# EAGLE board boardv3 (EAGLE 9.1.0)
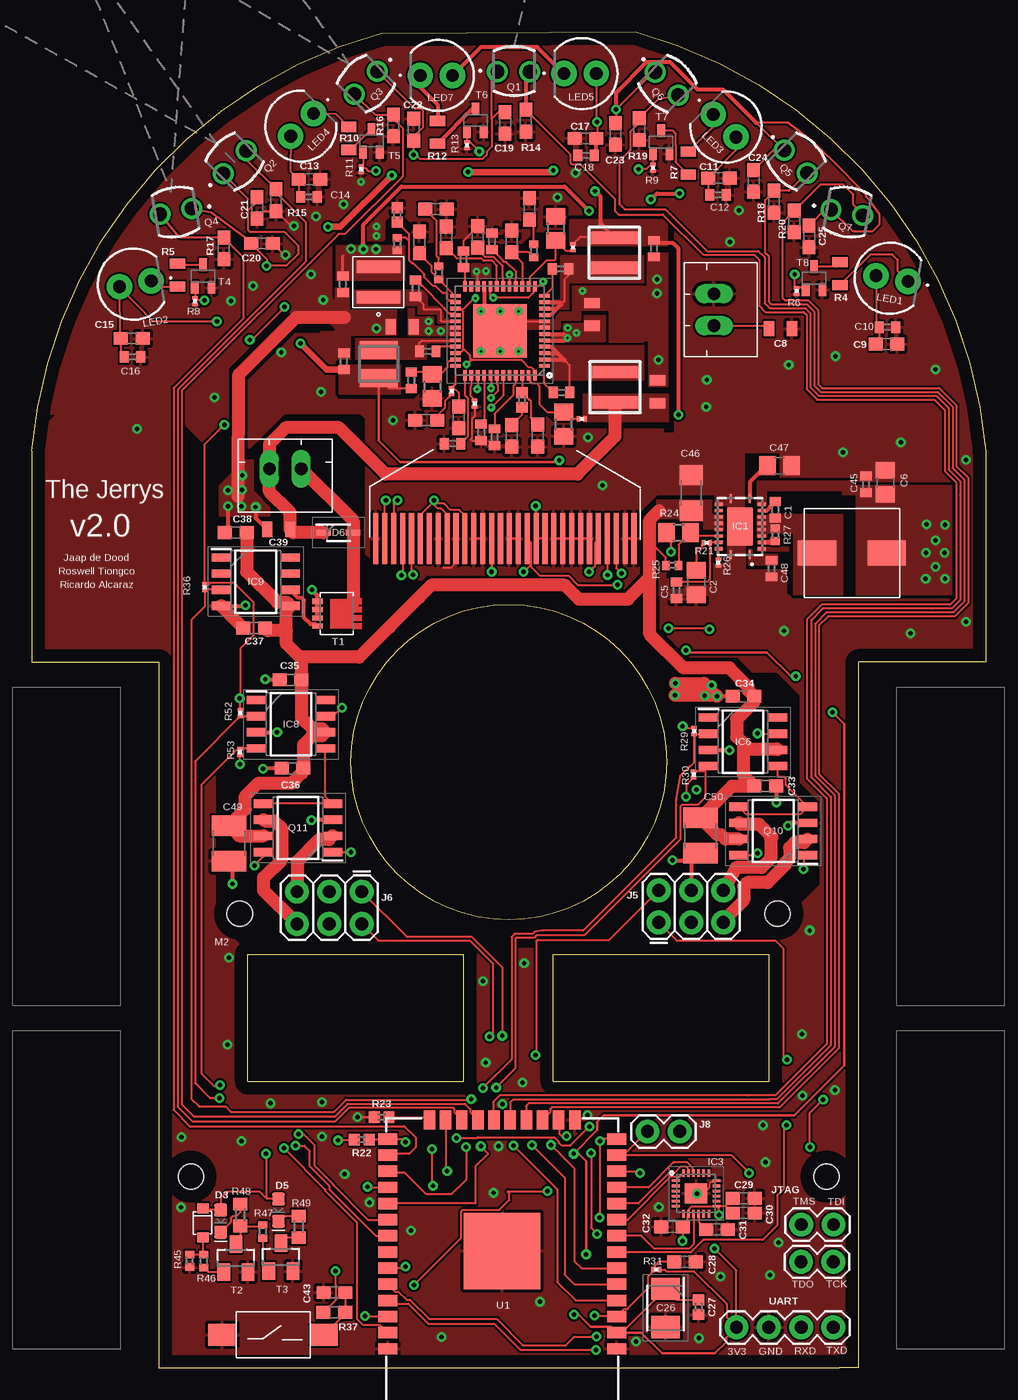
[diagram p3: board, top side]
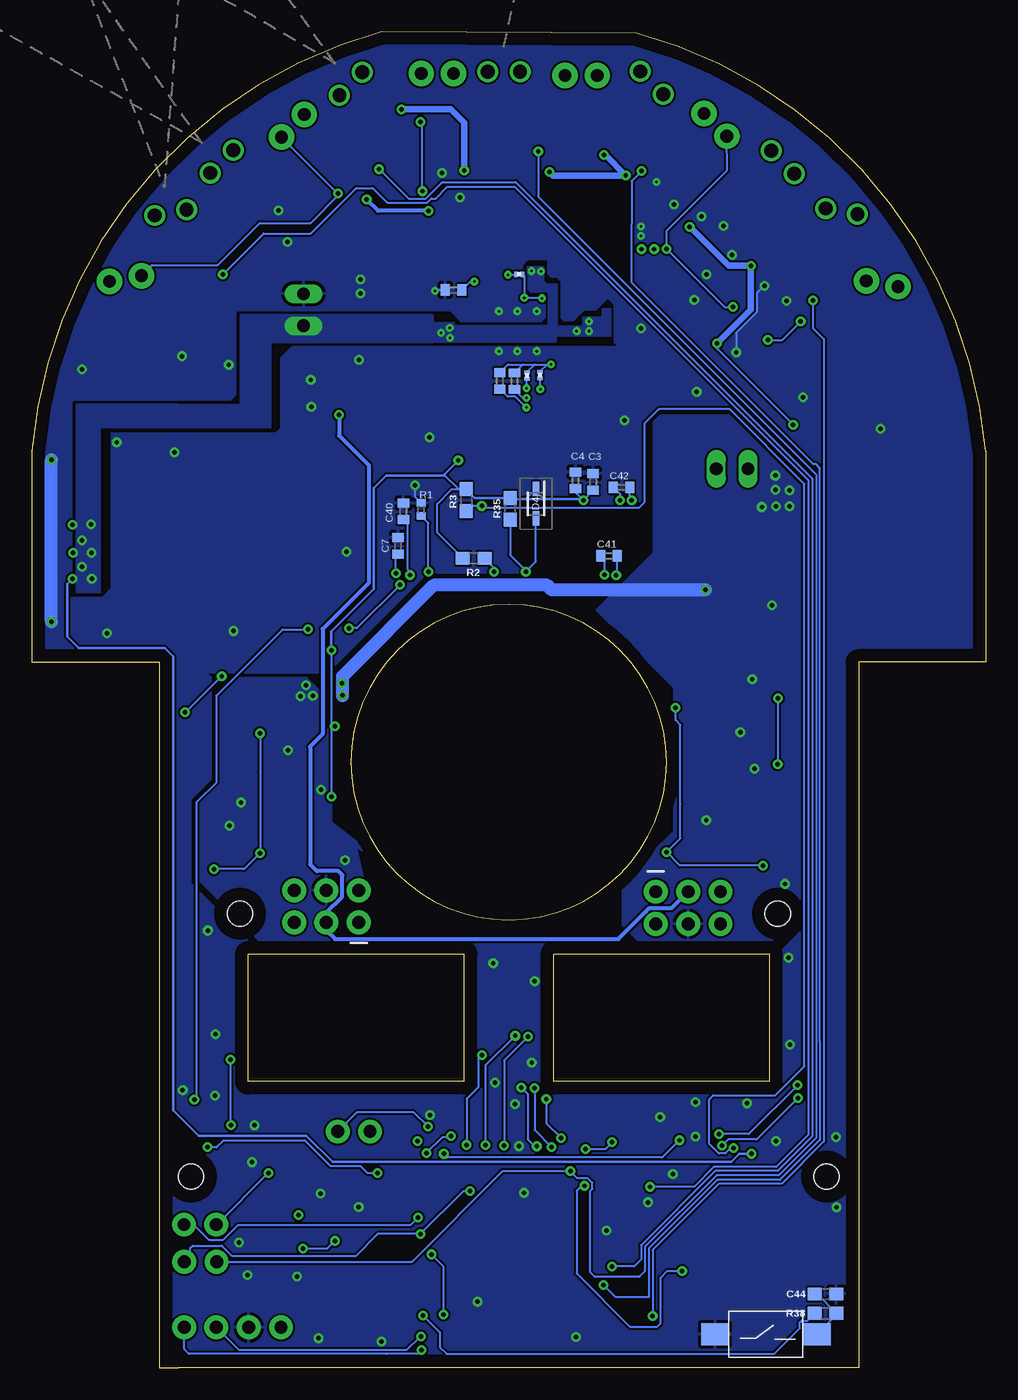
[diagram p4: board, bottom side, seen from below]

Size 75.02 x 105.1 mm. Coordinates in mm from the lower left corner, seen from the top.
Outline: 10,0 63.51,0 65.01,0.01 65.01,55.5 75.02,55.51 75.02,72.11 arc70 47.5,105.1 27.5,105 arc70 0,72.1 0,55.5 10,55.5 10,0
Outline: 16.99,22.52 16.99,32.52 33.99,32.52 33.99,22.52 16.99,22.52
Outline: 41.01,22.52 41.01,32.52 58.01,32.52 58.01,22.52 41.01,22.52
Outline: 25.1,47.64 arc-180 49.92,47.64 arc-180 25.1,47.64
Copper layers (1*16): Top 0.035mm / dielectric 1.5mm / Bottom 0.035mm
Design rules "default *": minimum track width 3.5mil, minimum drill 0.2mm, track to track 6mil, track to pad 6mil, pad to pad 6mil, via to via 6mil, smd to smd 6mil, copper to edge 40mil, drill to drill 6mil, minimum pad ring 10mil, minimum via ring 8mil, stop-mask expansion 4mil, vias tented up to drill 0mil, thermal gap 10mil
Holes 2 mm at 16.35,35.71 58.65,35.71 12.51,15.03 62.5,15.03

## Footprints (pad centres in the part's own frame; a part is rotated, then mirrored left to right if it is on the bottom)
C0402 = smd 0.7 x 0.9: 1 -0.65,0; 2 0.65,0
C0805 = smd 1.3 x 1.5: 1 -0.95,0; 2 0.95,0
0805 = smd 0.8 x 1.2: 1 -0.9,0; 2 0.9,0
0603 = smd 1.1 x 1: 1 -0.85,0; 2 0.85,0
CAPPM3528X210N = smd 1.75 x 2.25: 1 -1.5,0; 2 1.5,0
0402 = smd 0.85 x 0.9: 1 -0.58,0; 2 0.58,0
C1206 = smd 1.6 x 1.8: 1 -1.4,0; 2 1.4,0
C1210 = smd 1.6 x 2.7: 1 -1.4,0; 2 1.4,0
C0603 = smd 1.1 x 1: 1 -0.85,0; 2 0.85,0
LED-0603 = smd 1 x 1: A -0.877,0; C 0.877,0
SOD2713X115N = smd 1.125 x 0.5: 1 -1.162,0; 2 1.162,0
RHL(R-PVQFN-N20)_1 = smd 0.7 x 0.25: 1 -2.2,-0.75; 10 2.2,-0.75; 11 2.2,0.75; 20 -2.2,0.75 | smd 0.25 x 0.7: 2 -1.75,-1.7; 3 -1.25,-1.7; 4 -0.75,-1.7; 5 -0.25,-1.7; 6 0.25,-1.7; 7 0.75,-1.7; 8 1.25,-1.7; 9 1.75,-1.7; 12 1.75,1.7; 13 1.25,1.7; 14 0.75,1.7; 15 0.25,1.7; 16 -0.25,1.7; 17 -0.75,1.7; 18 -1.25,1.7; 19 -1.75,1.7 | smd 3.05 x 2.05: 21 0,0
QFN40P300X300X95-25N = smd 0.6 x 0.2: 1 -1.6,1; 2 -1.6,0.6; 3 -1.6,0.2; 4 -1.6,-0.2; 5 -1.6,-0.6; 6 -1.6,-1; 13 1.6,-1; 14 1.6,-0.6; 15 1.6,-0.2; 16 1.6,0.2; 17 1.6,0.6; 18 1.6,1 | smd 0.2 x 0.6: 7 -1,-1.6; 8 -0.6,-1.6; 9 -0.2,-1.6; 10 0.2,-1.6; 11 0.6,-1.6; 12 1,-1.6; 19 1,1.6; 20 0.6,1.6; 21 0.2,1.6; 22 -0.2,1.6; 23 -0.6,1.6; 24 -1,1.6 | smd 1.75 x 1.59: 25 0,0
SOIC127P600X175-8N = smd 1.525 x 0.65: 1 -2.712,1.905; 2 -2.712,0.635; 3 -2.712,-0.635; 4 -2.712,-1.905; 5 2.712,-1.905; 6 2.712,-0.635; 7 2.712,0.635; 8 2.712,1.905
2_PIN_JST-XH = drill 1 long: P$1 2.45,3.4; P$2 4.95,3.4
1X02 = drill 1.016 pad 1.88: 1 0,0; 2 2.54,0
2X3 = drill 1.016 pad 1.88: 1 0,0; 2 0,2.54; 3 2.54,0; 4 2.54,2.54; 5 5.08,0; 6 5.08,2.54
XAL4030-332MEB = smd 0.98 x 3.7: 1 -1.185,0; 2 1.185,0
SDR0302-471KL = smd 3 x 1.4: 1 0,1.1; 2 0,-1.1
XFL4020-222ME = smd 0.98 x 3.4: 1 -1.185,0; 2 1.185,0
SFH_4556P = drill 1 pad 2: 1 -1.27,0; 2 1.27,0
3X6X2.5MMSPB = smd 2.2 x 1.7: 1 0,0; 2 8,0
DO-219AC = smd 0.8 x 0.9: A 0,0; K 2.3,0
QFN50P700X700X100-49N = smd 0.8 x 0.3: 1 -3.5,2.75; 2 -3.5,2.25; 3 -3.5,1.75; 4 -3.5,1.25; 5 -3.5,0.75; 6 -3.5,0.25; 7 -3.5,-0.25; 8 -3.5,-0.75; 9 -3.5,-1.25; 10 -3.5,-1.75; 11 -3.5,-2.25; 12 -3.5,-2.75; 25 3.5,-2.75; 26 3.5,-2.25; 27 3.5,-1.75; 28 3.5,-1.25; 29 3.5,-0.75; 30 3.5,-0.25; 31 3.5,0.25; 32 3.5,0.75; 33 3.5,1.25; 34 3.5,1.75; 35 3.5,2.25; 36 3.5,2.75 | smd 0.3 x 0.8: 13 -2.75,-3.5; 14 -2.25,-3.5; 15 -1.75,-3.5; 16 -1.25,-3.5; 17 -0.75,-3.5; 18 -0.25,-3.5; 19 0.25,-3.5; 20 0.75,-3.5; 21 1.25,-3.5; 22 1.75,-3.5; 23 2.25,-3.5; 24 2.75,-3.5; 37 2.75,3.5; 38 2.25,3.5; 39 1.75,3.5; 40 1.25,3.5; 41 0.75,3.5; 42 0.25,3.5; 43 -0.25,3.5; 44 -0.75,3.5; 45 -1.25,3.5; 46 -1.75,3.5; 47 -2.25,3.5; 48 -2.75,3.5 | smd 4.18 x 4.18: 49 0,0
TEFT4300 = drill 1.09 pad 1.65: 1 -1.309,-0.054; 2 1.231,-0.054
R0402 = smd 0.6 x 0.7: 1 -0.5,0; 2 0.5,0
R0201 = smd 0.28 x 0.43: 1 -0.255,0; 2 0.255,0
R0805 = smd 1.3 x 1.5: 1 -0.95,0; 2 0.95,0
R0603 = smd 1 x 1.1: 1 -0.85,0; 2 0.85,0
R0402' = smd 0.7 x 0.9: 1 -0.65,0; 2 0.65,0
SOT1210 = smd 0.4 x 0.83: 1 -0.975,-1.535; 2 -0.325,-1.535; 3 0.325,-1.535; 4 0.975,-1.535 | smd 0 x 0: MB 0,0.432
SOT23 = smd 1 x 1.4: 1 -0.95,-1.1; 2 0.95,-1.1; 3 0,1.1
SOT323 = smd 0.6 x 1: D 0,0.9; G -0.65,-0.9; S 0.65,-0.9
ESP-WROOM-32 = smd 0.9 x 1.5: 1 7.7,9; 2 6.43,9; 3 5.16,9; 4 3.89,9; 5 2.62,9; 6 1.35,9; 7 0.08,9; 8 -1.19,9; 9 -2.46,9; 10 -3.73,9; 11 -5,9; 12 -6.27,9; 13 -7.54,9; 14 -8.81,9; 25 -8.81,-9; 26 -7.54,-9; 27 -6.27,-9; 28 -5,-9; 29 -3.73,-9; 30 -2.46,-9; 31 -1.19,-9; 32 0.08,-9; 33 1.35,-9; 34 2.62,-9; 35 3.89,-9; 36 5.16,-9; 37 6.43,-9; 38 7.7,-9 | smd 1.5 x 0.9: 15 -10.3,5.715; 16 -10.3,4.445; 17 -10.3,3.175; 18 -10.3,1.905; 19 -10.3,0.635; 20 -10.3,-0.635; 21 -10.3,-1.905; 22 -10.3,-3.175; 23 -10.3,-4.445; 24 -10.3,-5.715 | smd 6 x 6: GND 0,0
30PINFPC_P0.7MM = smd 0.4 x 4: 1 0,0; 2 0.7,0; 3 1.4,0; 4 2.1,0; 5 2.8,0; 6 3.5,0; 7 4.2,0; 8 4.9,0; 9 5.6,0; 10 6.3,0; 11 7,0; 12 7.7,0; 13 8.4,0; 14 9.1,0; 15 9.8,0; 16 10.5,0; 17 11.2,0; 18 11.9,0; 19 12.6,0; 20 13.3,0; 21 14,0; 22 14.7,0; 23 15.4,0; 24 16.1,0; 25 16.8,0; 26 17.5,0; 27 18.2,0; 28 18.9,0; 29 19.6,0; 30 20.3,0
MLC7540 = smd 2 x 3: P$1 0,0; P$2 0,5.5
1X04 = drill 1.016 pad 1.88: 1 0,0; 2 2.54,0; 3 5.08,0; 4 7.62,0

## Placement (x,y rotation side)
C1  100nF  [C0402]  58.47,67.5 270 top
C2  1nF  [C0805]  52.26,61.77 270 top
C3  1uF  [C0402]  30.87,69.68 90 bottom
C4  1uF  [C0402]  32.26,69.8 90 bottom
C5  43pF  [C0402]  50.7,61.17 270 top
C6  100nF  [C0805]  67.13,69.65 90 top
C7  2.2uF  [C0402]  46.22,64.66 90 bottom
C8  22uF  [0805]  58.88,81.75 180 top
C9  4.7uF  [0603]  67.23,80.52 0 top
C10  0.1uF  [C0402]  67.3,81.86 0 top
C11  4.7uF  [0603]  54.03,93.59 0 top
C12  0.1uF  [C0402]  53.98,92.26 0 top
C13  4.7uF  [0603]  21.83,93.49 0 top
C14  0.1uF  [C0402]  21.79,92.11 0 top
C15  4.7uF  [0603]  7.86,80.97 0 top
C16  0.1uF  [C0402]  7.91,79.52 0 top
C17  4.7uF  [0603]  43.54,96.71 180 top
C18  0.1uF  [C0402]  43.58,95.36 180 top
C19  2.2uF  [0603]  37.22,97.93 270 top
C20  2.2uF  [0603]  18.1,88.44 0 top
C21  2.2uF  [0603]  17.72,91.23 270 top
C22  2.2uF  [0603]  30.04,97.4 90 top
C23  2.2uF  [0603]  45.9,97.06 270 top
C24  2.2uF  [0603]  56.76,93.36 270 top
C25  2.2uF  [0603]  61.13,89.01 270 top
C26  100uF Tantal.  [CAPPM3528X210N]  49.84,4.71 270 top
C27  1.0uF  [0402]  52.44,4.76 270 top
C28  1nF  [0603]  51.38,8.33 0 top
C29  0.1uF  [0603]  55.99,13.33 0 top
C30  2.2uF  [0603]  55.99,12.17 0 top
C31  0.1uF  [0603]  53.89,10.88 0 top
C32  10nF  [0603]  50.35,11.09 180 top
C33  0.1uF  [0603]  57.68,45.76 0 top
C34  4.7uF  [0603]  55.96,52.82 180 top
C35  0.1uF  [0603]  20.35,54.12 180 top
C36  4.7uF  [0603]  20.5,47.16 180 top
C37  0.1uF  [0603]  17.49,58.2 180 top
C38  4.7uF  [0603]  16.04,65.71 180 top
C39  22uF  [0805]  19.42,65.95 180 top
C40  4.7uF  [C0402]  45.8,67.37 90 bottom
C41  1uF  [C0402]  29.63,63.86 180 bottom
C42  1uF  [C0402]  28.63,69.27 180 bottom
C43  1nF  [0603]  23.82,5.92 0 top
C44  1nF  [0603]  12.59,5.8 180 bottom
C45  10uF  [C0402]  65.6,69.49 90 top
C46  33uF  [C1206]  51.87,68.82 90 top
C47  8.2nF  [C0805]  58.79,70.96 0 top
C48  4.7uF  [C0402]  58.18,62.87 270 top
C49  100UF_CERAMIC  [C1210]  15.5,41.25 270 top
C50  100UF_CERAMIC  [C1210]  52.58,41.87 270 top
CBST1  100nF  [C0402]  41.67,76.72 0 top
CBST2  100nF  [C0402]  41.58,86.44 0 top
CBST3  100nF  [C0402]  30.19,84.92 90 top
CBST4  100nF  [C0402]  31.14,79.96 0 top
CCOMP5  25pF  [C0603]  37.75,88.61 90 top
CCOMP6  1.2nF  [C0603]  31.79,91.14 0 top
CCOMP7  43pF  [C0603]  30.48,88.52 90 top
CCOMP8  1.8nF  [C0603]  39.14,91.15 270 top
CCOMP9  4.7nF  [C0603]  31.02,74.54 0 top
CCOMP10  82pF  [C0603]  33.57,74.77 270 top
CCOMP11  1.2nF  [C0603]  37.74,73.3 90 top
CCOMP13  39pF  [C0603]  39.79,73.33 90 top
CIN1  22.2uF  [0805]  29.13,81.89 180 top
CIN2  22.2uF  [0805]  44.05,82.86 90 top
CIN3  22.2uF  [0805]  49.2,76.77 90 top
COUT1  10uF  [C0402]  24.46,85.24 270 top
COUT5  10uF  [C0402]  48.93,88.04 270 top
COUT6  10uF  [C0402]  24.54,79.18 270 top
CSS5  68nF  [C0402]  36.2,88.61 90 top
CSS6  68nF  [C0402]  33.96,87.2 90 top
CSS7  68nF  [C0402]  33.09,72.7 180 top
CSS8  68nF  [C0402]  36.4,73.21 90 top
CVDD1  3.3uF  [C0402]  41.85,84.78 180 bottom
CVDDA1  4.7uF  [0603]  32.59,88.92 270 top
CVDDG1  10uF  [C0603]  35.08,88.95 90 top
D3  GREEN  [LED-0603]  14.85,11.54 270 top
D4  1N4148WS-E3-08  [SOD2713X115N]  35.37,67.98 270 bottom
D5  RED  [LED-0603]  19.4,12.4 270 top
D6  1N4148WS-E3-08  [SOD2713X115N]  24.11,65.7 0 top
IC1  TPS61088RHLR  [RHL(R-PVQFN-N20)_1]  55.71,66.18 90 top
IC3  MPU-6500  [QFN40P300X300X95-25N]  52.24,13.71 0 top
IC6  UCC27523DR  [SOIC127P600X175-8N]  55.94,49.24 0 top
IC8  UCC27523DR  [SOIC127P600X175-8N]  20.38,50.62 0 top
IC9  UCC27523DR  [SOIC127P600X175-8N]  17.61,61.84 0 top
J2  2_PIN_JST-XH  [2_PIN_JST-XH]  57.05,79.53 90 top
J3  [1X02]  60.51,11.26 0 top
J5  [2X3]  49.31,35.02 0 top
J6  [2X3]  25.94,37.45 180 top
J7  2_PIN_JST-XH  [2_PIN_JST-XH]  16.24,67.31 0 top
J8  [1X02]  50.96,18.58 180 top
JTAG  [1X02]  60.49,8.34 0 top
L5  XAL4030-332MEB  [XAL4030-332MEB]  45.82,87.71 270 top
L6  SDR0302-100ML  [SDR0302-471KL]  27.28,78.96 0 top
L7  XAL4030-472MEB  [XAL4030-332MEB]  45.86,77.14 90 top
L8  XFL4020-472MEB  [XFL4020-222ME]  27.26,85.4 90 top
LED1  SFH4545  [SFH_4556P]  67.65,85.69 170 top
LED2  SFH4545  [SFH_4556P]  8.14,85.27 190 top
LED3  SFH4545  [SFH_4556P]  54.49,97.71 315.1 top
LED4  SFH4545  [SFH_4556P]  21.26,97.78 224.9 top
LED5  SFH4545  [SFH_4556P]  43.12,101.81 0 top
LED7  SFH4545  [SFH_4556P]  31.82,101.67 0 top
PB1  [3X6X2.5MMSPB]  14.98,2.59 0 top
PB2  [3X6X2.5MMSPB]  21.29,2.63 0 bottom
PLZ6V2B-G3/H  6.3V Zener  [DO-219AC]  13.45,10.25 90 top
PS2  TPS65400RGZT  [QFN50P700X700X100-49N]  36.82,81.57 180 top
Q1  TEFT4300  [TEFT4300]  37.93,102.02 0 top
Q2  TEFT4300  [TEFT4300]  15.95,94.9 44.9 top
Q3  TEFT4300  [TEFT4300]  26.28,101.02 224.9 top
Q4  TEFT4300  [TEFT4300]  11.31,90.92 190 top
Q5  TEFT4300  [TEFT4300]  60.15,94.9 315.1 top
Q6  TEFT4300  [TEFT4300]  49.99,101.02 315.1 top
Q7  TEFT4300  [TEFT4300]  64.15,90.92 350 top
Q10  ZXMHC3F381N8TC  [SOIC127P600X175-8N]  58.31,42.23 180 top
Q11  ZXMHC3F381N8TC  [SOIC127P600X175-8N]  20.93,42.47 180 top
R1  910k  [R0402]  44.4,67.53 270 bottom
R2  4.7k  [0603]  40.26,63.68 180 bottom
R3  4.7k  [0603]  40.85,68.26 90 bottom
R4  0.75  [0805]  63.55,86.08 270 top
R5  0.75  [0805]  11.45,85.96 270 top
R6  10k  [R0201]  60.15,84.71 90 top
R7  0.75  [0805]  51.63,94.77 90 top
R8  10k  [R0201]  12.84,83.91 90 top
R9  10k  [R0201]  48.85,94.41 90 top
R10  0.75  [0805]  24.93,96.71 90 top
R11  10k  [R0201]  25.91,94.28 90 top
R12  5R  [0805]  31.91,97.19 90 top
R13  10k  [R0201]  34.22,96.17 90 top
R14  1.8k  [0603]  38.86,98.1 90 top
R15  1.8k  [0603]  19.21,91.85 90 top
R16  1.8k  [0603]  28.44,97.73 90 top
R17  1.8k  [0603]  15.11,88.06 90 top
R18  1.8k  [0603]  58.38,91.73 90 top
R19  1.8k  [0603]  47.78,97.44 90 top
R20  1.8k  [0603]  59.97,90.19 90 top
R21  36.5k  [R0201]  53.09,64.9 0 top
R22  5K(NC)  [0402]  25.95,17.95 180 top
R23  5K(NC)  [0402]  27.51,19.71 0 top
R24  92k  [R0805]  50.87,65.7 0 top
R25  825k  [R0402]  50.37,63.12 180 top
R26  105k  [R0201]  53.99,63.33 90 top
R27  267k  [R0402]  58.48,65.53 90 top
R29  10k  [R0201]  52.09,50.08 90 top
R30  10k  [R0201]  52.05,46.68 270 top
R31  12k  [R0201]  49.1,7.72 0 top
R35  4.7k  [0603]  37.4,67.58 90 bottom
R36  10k  [R0201]  13.61,61.4 90 top
R37  470  [0603]  23.79,4.36 180 top
R38  470  [0603]  12.6,4.29 180 bottom
R45  10k  [R0402]  12.41,8.41 90 top
R46  47k  [R0402]  13.52,8.39 270 top
R47  47k  [R0402]  18.17,10.71 270 top
R48  [R0603]  16.41,12.02 90 top
R49  [R0603]  20.98,11.09 90 top
R52  10k  [R0201]  16.4,51.51 90 top
R53  10k  [R0201]  16.36,48.45 270 top
RCOMP5  10.7k  [0402]  38.55,76.14 270 top
RCOMP6  10.7k  [R0402]  39.49,87.86 270 top
RCOMP7  9.31k  [R0402]  32.01,86.13 270 top
RCOMP8  10k  [R0201]  33.02,76.83 270 top
RFBB5  20k  [R0805]  41.2,89.62 270 top
RFBB6  14k  [0402]  28.74,90.69 270 top
RFBB7  24k  [R0805]  31.5,77.2 270 top
RFBB8  20k  [R0805]  41.83,74.23 90 top
RFBT5  75k  [R0402']  29.84,77.68 90 top
RFBT6  105k  [R0201]  43.25,74.65 0 top
RFBT8  21k  [R0402]  28.74,88.39 270 top
RFTB5  105k  [R0201]  42.56,88.14 90 top
ROSC1  113k  [R0402']  35.34,73.58 90 top
RPMU7  23.7k  [R0201]  34.83,75.86 270 top
RPMU8  10k  [R0201]  36.08,78.06 90 bottom
RPMU9  10k  [R0201]  35.06,78.09 90 bottom
RPMU10  2.94k  [R0402']  37.06,77.62 90 bottom
RPMU11  2.94k  [R0402']  38.22,77.63 90 bottom
RPMU12  10k  [R0201]  36.7,86.02 0 bottom
T1  PSMN3R9-25MLC  [SOT1210]  24,59.32 270 top
T2  BC847  [SOT23]  16.05,8.63 0 top
T3  BC847  [SOT23]  19.59,8.7 0 top
T4  DMN3150LW  [SOT323]  13.47,85.88 0 top
T5  DMN3150LW  [SOT323]  26.71,96.52 0 top
T6  DMN3150LW  [SOT323]  34.89,98.13 0 top
T7  DMN3150LW  [SOT323]  49.5,96.41 0 top
T8  DMN3150LW  [SOT323]  61.52,85.72 0 top
U1  ESP-WROOM-32  [ESP-WROOM-32]  36.99,9.19 270 top
U$8  SSD1306  [30PINFPC_P0.7MM]  27.06,65.24 0 top
U$9  MLC7540  [MLC7540]  67.25,64.09 90 top
UART  [1X04]  55.42,3.17 0 top

## Tracks (layer width: path | path; a pad name or v marks a point on that pad's centre or on a via)
2V  (via drill 0.35)
  Top 0.152: C16.1 7.01,79.77 C15.1 6.91,81.07 LED2.2 9.56,82.31 v14.55,82.31 | LED4.2 20.34,94.13 C13.1 20.98,92.27 C14.1 | LED3.2 55.32,95.73 C11.1 53.18,92.41 C12.1 | LED1.2 66.4,82.11 C10.1 66.65,80.79 C9.1 | v19.88,83.45 17.29,80.86 v17.14,80.86
  Top 0.254: COUT1.1 24.46,87.45
  Top 0.305: v26.07,88 26.07,89.93 29.06,92.92 41.91,92.92 v43.82,91.01 | v48.68,91.9 49.15,92.37 v50.94,92.37
  Bottom 0.152: LED4.2 20.34,94.2 25.1,89.44 v25.1,88.01 20.54,83.45 v19.88,83.45 | LED3.2 v50.94,92.37 50.86,92.29 53.09,90.06 57.1,90.06 60.41,86.75 65.57,86.75 LED1.2 | v17.14,80.86 16,80.86 v14.55,82.31
  Bottom 0.305: v43.82,91.01 47.79,91.01 v48.68,91.9
  other vias: 27.08,88
  pour Top (no thermals): 29.29,85.56 23.99,85.56 23.99,88.28 29.29,88.28
3V3  (via drill 0.35)
  Top 0.152: Q4.1 14.12,90.9 16.67,89.02 C20.1 18.47,87.22 v18.47,86.69 20.01,86.69 20.94,87.62 20.94,87.89 20.94,88.27 19.84,89.37 17.16,89.37 16.99,89.54 16.99,91.02 | C21.1 17.72,91.75 16.99,91.02 | 16.99,91.02 16.99,91.96 Q2.1 | 36.17,98.26 36.17,96.04 35.8,95.67 35.8,95.45 35.44,95.09 30.56,95.09 30.04,95.61 30.04,95.44 v30.02,95.42 30.02,96.45 30.04,96.47 C22.1 30.04,96.88 30.77,97.61 30.77,98.89 30.63,99.03 30.13,99.03 Q3.1 | 36.17,98.26 36.17,101.52 Q1.1 | 36.17,98.26 36.69,98.78 C19.1 | C25.1 62.4,91.13 Q7.1 64.55,89.43 66.14,89.43 66.68,89.97 66.68,90.76 65.95,91.78 65.62,92.11 65.62,92.24 63.72,94.2 61.53,96.39 59.45,97.96 57,97.96 56.97,97.93 Q5.1 58.32,95.77 C24.1 | C23.1 45.95,97.96 v45.95,99 48.35,101.39 Q6.1 | RFBT5.1 28.11,77.03 L6.2 | v15.14,74.18 13.61,72.65 R36.2 13.94,61.66 14.04,61.76 15.89,61.76 17.43,60.22 17.43,57.61 16.4,56.59 16.4,52.73 v16.35,52.68 16.35,51.81 R52.2 | U1.2 46.39,2.76 C26.1 50.71,5.34 C27.1 | R31.2 49.77,7.72 49.88,7.6 52.06,7.6 54.64,5.02 54.64,3.95 UART.1 55.42,7.65 v53.68,9.39 | C29.1 54.52,12.71 IC3.13 | C30.1 54.6,12.71 IC3.13 | v51.18,9.98 51.2,10 C32.1 51.2,11.35 51.57,11.71 51.57,12.04 IC3.8 51.71,12.18 51.71,12.5 51.89,12.69 53.21,12.69 53.23,12.71 IC3.13 | R22.2 25.31,17.89 v24.09,17.89 | v51.19,50.47 51.32,50.33 R29.2 | R30.2 51.45,45.83 v51.45,44.91 | v16.36,47.47 R53.2 | v54.04,12.02 54.04,12.51 IC3.13 | U$8.6 30.56,67.09 31.5,68.03 31.54,67.99 | 31.54,67.99 31.93,67.6 32.2,67.6 32.66,67.13 U$8.9 | U$8.11 34.06,67.06 33.63,67.49 32.91,67.49 32.43,67.97 31.56,67.97 31.54,67.99
  Top 0.203: L6.2 27.28,72.93 28.98,71.23 41.33,71.23 v41.48,71.38 | v51.46,56.45 51.63,56.28 57.79,56.28 59.67,54.4 v60.08,54.4 | v62.97,51.57 63.89,50.65 63.89,23.78 59.95,19.84 44.99,19.84 44.48,19.33 44.48,18.71 42.62,16.85 v42.62,16.83 43.02,16.83 43.61,16.24 v43.61,8.93 v43.6,8.92 | v31.63,68.24 31.63,68.08 31.54,67.99 | v42.65,4.18 43,4.18 43.97,3.21 45.54,3.21 U1.2 47.93,2.76 49.57,1.12 53.71,1.12 54.61,2.02 54.61,2.36 UART.1
  Top 0.305: v45.95,99 45.95,100.32 48.36,102.73 50.19,102.73 52.35,100.57 54.34,100.57 56.97,97.93
  Top 0.508: COUT6.2 23.19,78.53 v21.13,80.59 | v23.28,89.75 24.27,89.75 v28.31,93.79 | v34.32,94.06 40.88,94.06 v41.01,94.19
  Bottom 0.152: v15.14,74.18 21.13,80.17 v21.13,80.59 | v42.62,16.83 42.33,16.54 25.44,16.54 v24.09,17.89 | v51.46,56.45 51.46,50.74 v51.19,50.47 51.45,50.21 v51.45,44.91 | v16.36,47.47 v16.36,52.67 v16.35,52.68 | v43.6,8.92 42.65,7.97 v42.65,4.18 | v53.68,9.39 51.77,9.39 v51.18,9.98 | R2.2 43.15,65.72 43.15,67.95 41.99,69.11 41.33,69.11 | 36.16,68.35 D4.1 | R35.2 37.32,68.35 36.57,68.35
  Bottom 0.203: v51.46,56.45 51.46,57.91 48.13,61.24 48.13,69.22 47.16,70.19 42.53,70.19 | v60.08,54.4 62.91,51.57 v62.97,51.57 | v41.48,71.38 42.6,70.26 42.53,70.19 | 36.57,68.35 36.16,68.35 36.02,68.35 | 36.02,68.35 31.74,68.35 v31.63,68.24 | v31.63,68.24 31.63,68.27 C3.1 | C4.1 32.26,68.87 v31.63,68.24 | 36.02,68.35 | R35.2 40.17,68.43 R3.2 41.33,69.11 41.45,69.11 42.53,70.19
  Bottom 0.508: v21.13,80.59 18.47,83.25 v18.47,86.69 20.22,86.69 v23.28,89.75 | v34.32,94.06 34.05,93.79 v28.31,93.79 29.94,95.42 v30.02,95.42 | v41.01,94.19 41.01,97.94 42.07,99 v45.95,99
  pour Top (no thermals): 24.23,78.87 28.93,78.87 28.93,76.6 24.23,76.6
5V  (via drill 0.35)
  Top 0.152: RFTB5.2 43.16,88.99 45.73,88.99 L5.1 | LED5.2 44.39,98.09 v44.46,98.02 44.46,96.78 C17.1
  Top 0.305: L5.1 44.73,89.99 44.73,92.13 v44.3,92.56 | C18.1 44.39,95.52 C17.1 44.47,96.79 | COUT5.1 49.13,88.49 50.4,88.49 50.83,88.06 50.83,74.98 v50.85,74.96
  Bottom 0.152: v44.3,92.56 44.3,97.86 v44.46,98.02
  Bottom 0.305: v50.85,74.96 50.85,73.33 48.54,71.02 48.54,61.73 52.15,58.12 52.15,49.86 53.13,48.87 53.13,39.61 52.6,39.07 50.91,39.07 50.6,38.76 50.6,38.75 50.6,37.04 51.85,35.8 J5.3 51.85,34.4 51.17,33.71 28.9,33.71 26.72,35.89 26.46,36.16 24.7,36.16 J6.3
  pour Top (no thermals): 49.94,88.29 42.36,88.29 42.36,90.31 49.94,90.31
5V_FAN
  Top 1.016: L7.1 45.86,73.26 42.9,70.3 27.83,70.3 24.17,73.96 19.97,73.96 18.69,72.68 J7.P$1 18.69,68.93 20.32,67.3 C39.1 20.57,65.7 D6.1
  pour Top (no thermals): 43.37,76.57 43.37,74.46 50.06,74.46 50.06,76.57
BOOSTEN
  pour Top (no thermals): 57.73,64.52 57.08,64.52 57.08,64.36 57.08,64.28 59.52,64.28 59.52,64.49 57.73,64.49
CB1
  Top 0.152: CBST1.1 40.32,77.42 PS2.1
CB2
  Top 0.152: CBST2.1 40.93,84.93 PS2.12
CB3
  Top 0.152: CBST3.2 30.64,85.12 30.71,85.12 32.46,83.38 32.46,83.31 32.82,82.94 33.2,82.94 PS2.28
CB4
  Top 0.152: PS2.33 32.15,80.32 CBST4.2
COMP1
  Top 0.152: PS2.46 38.57,76.74 RCOMP5.1 39.06,76.21 39.1,76.21 39.23,76.08 39.23,74.74 CCOMP13.2
COMP2
  Top 0.152: PS2.15 38.57,86.94 CCOMP5.1 39.09,87.76 RCOMP6.2
COMP3
  Top 0.152: CCOMP7.1 31.43,86.72 31.43,86.23 32.01,85.66 RCOMP7.2 PS2.25
COMP4
  Top 0.152: PS2.36 33.32,77.38 RCOMP8.1 33.16,76.94 33.33,76.94 33.57,76.7 CCOMP10.1
CS
  Top 0.152: IC3.22 51.97,15.38 51.97,15.74 51.56,16.14 50.45,16.14 48.5,14.19 U1.11
EN  (via drill 0.35)
  Top 0.152: v44.24,4.1 45.92,4.1 U1.3 46.58,4.62 46.84,4.62 48.49,6.27 48.49,7.18 48.89,7.59 48.89,7.77 | 48.89,7.77 48.99,7.86 48.99,8.03 49.29,8.33 C28.1 | 48.89,7.77 R31.1
  Bottom 0.152: v44.24,4.1 42.93,2.79 42.93,1.62 42.4,1.09 16.65,1.09 14.62,3.12 14.62,3.57 14.48,3.71 14.03,3.71 R38.2
F_RECEIVER
  Top 0.152: R14.2 42.35,95.46 42.35,94.81 42.49,94.68 43.13,94.68 45.85,91.96 45.85,91.04 46.16,90.73 49.63,90.73 52.81,87.55 56.8,87.55 57.19,87.16 57.19,83.54 57.67,83.06 60.7,83.06 60.93,82.83 60.93,77 61.77,76.16 70.99,76.16 71.8,75.35 71.8,70.54 72.71,69.63 72.71,60.52 72.23,60.04 62.11,60.04 60.95,58.88 60.95,46.37 62.53,44.79 62.53,25.5 58.46,21.43 56.3,21.43 56.28,21.41 36.79,21.41 36.28,20.9 36.28,19.57 U1.20
  Top 0.305: Q1.2 38.86,101.67 R14.2
FANPWM  (via drill 0.35)
  Top 0.152: IC9.3 13.67,61.2 R36.1 13.61,59.89 12.55,58.83 12.55,21.17 13.17,20.55 15.26,20.55 15.67,20.14 23.78,20.14 24.72,21.08 34.51,21.08 v34.56,21.13 | v33.4,18.07 35.03,18.07 35.1,18.14 41.08,18.14 41.44,17.78 41.44,17.68 41.64,17.48 42.36,17.48 v43.85,18.97
  Bottom 0.152: J8.1 49.45,20.09 44.97,20.09 v43.85,18.97 | v34.56,21.13 34.56,19.23 v33.4,18.07
FANPWM/TMS  (via drill 0.35)
  Top 0.152: J8.2 46.57,16.73 U1.13 55,16.73 v56.41,15.32
  Bottom 0.152: v56.41,15.32 60.47,11.26 J3.1
GND  (via drill 0.2, 0.35)
  Top 0.152: U$8.25 U$8.24 U$8.23 U$8.22 U$8.21 | U$8.17 U$8.16 | U$8.13 U$8.12 | 32.37,62.91 32.96,62.91 33.36,63.32 U$8.10 | U$8.30 U$8.29 | R23.1 v25.6,19.71 | PS2.8 38.79,82.32 38.04,81.57 PS2.49 35.57,82.82 | CSS6.2 33.96,88.68 CVDDG1.2 | RPMU7.2 34.83,74.84 34.6,74.62 34.6,73.13 34.52,73.05 34.64,72.93 ROSC1.1 | C21.2 18.34,91 R15.1 20.38,89.83 v20.63,89.83 | C20.2 19.85,87.53 v19.94,87.53 | R24.1 50.26,65.36 v50.26,64.2 | IC3.25 v52.31,13.71 52.84,13.71 53.31,14.18 53.31,14.5 53.45,14.64 53.77,14.64 IC3.18 | Q10.3 | v54.87,48.57
  Top 0.305: v15.42,67.77 15.42,65.94 C38.2 | v17.61,67.71 17.61,66.86 C39.2 | IC9.4 16.79,59.94 v16.82,59.97 | T1.3 T1.2 T1.1 22.46,60.75 v22.03,61.19 | C35.2 18.39,54.12 v18.36,54.15 | IC8.3 v19.3,49.98 | C36.2 18.2,47.16 v18.17,47.13 | Q11.3 22.02,43.1 v21.98,43.06 | C49.2 15.78,39.57 v15.78,38.06 | C34.2 v53.88,52.82 | IC6.3 53.26,48.57 v54.87,48.57 | C33.2 58.53,44.5 v58.56,44.47 | Q10.3 59.7,42.86 v59.48,42.65 | J5.4 51.85,39.74 52.03,39.92 | C50.2 52.26,40.14 52.03,39.92 | v50.39,39.92 52.03,39.92 | PS2.21 35.57,82.82
  Top 1.016: C37.2 IC9.4 | v50.59,52.91 53.79,52.91 v53.88,52.82 52.86,53.84 v50.61,53.84 | 16.23,68.54 16.28,78.13 20.8,82.65 24.58,82.65
  Bottom 0.152: CVDD1.2 43.25,84.78 v43.32,84.71 | v17.39,85.12 17.99,84.52 17.99,83.05 19.62,81.42 v19.62,79.88 | R1.1 44.88,68.51 v44.88,69.41 | v50.59,52.91 50.59,52.88 50.58,52.87
  Bottom 1.016: v73.48,58.69 73.48,71.39 v73.46,71.41 | v22.03,61.19 34.11,61.19 34.5,61.57 43.4,61.57 50.58,54.39 50.58,52.87
  other vias: 35.47,30.4 35.7,24 61.18,34.4 60.56,26.24 15.52,32.25 15.38,25.42 22.81,20.89 16.48,17.82 18.78,20.8 11.74,12.62 22.92,84.02 49.3,79.28 49.17,85.63 49.18,84.53 25.9,93.28 27.1,89.78 27.11,89.03 15.67,83.92 28.42,74.53 22.73,76.77 8.26,73.87 53.08,77.72 53.04,75.59 59.53,78.89 14.36,76.34 43.74,73.2 63.81,72.02 59.16,57.96 21.95,86.01 63.2,79.58 71.08,78.53 68.34,72.79 24.51,91.53 22.35,90.56 42.76,93.98 41.35,92.08 55.61,91.05 54.9,88.56 35.31,79.97 36.84,79.97 38.29,79.97 35.31,83.12 36.84,83.12 38.29,83.12 69.1,57.79 38.73,31.84 39.98,5.19 47.53,2.06 52.46,2.32 63.15,21.85 57.5,19.07 57.71,16.16 58.73,9.85 58.05,7.28 36.3,13.76 36.71,17.42 43.71,19.87 60.6,21.41 49.31,12.65 54.17,7.18 37.01,20.75 22.81,18.17 24.61,15.22 26.55,13.01 29.83,10.78 32.23,2.41 38.59,22.42 11.76,18.15 16.49,67.77 15.42,69.02 16.54,69.08 16.55,70.19 52.92,52.86 53.47,53.7 27.11,81.77 52.27,45.47
  pour Top (no thermals): 38.63,81.76 41.55,81.76 41.55,82.46 43.17,82.46 43.17,83.25 43.18,83.24 45.41,83.24 45.41,80.73 48.1,80.73 48.1,83.25 48.1,85.05 42.54,85.05 42.54,83 41.45,83 41.23,83 41.23,82.98 41.23,82.4 38.63,82.4
  pour Top (no thermals): 56.02,67.65 56.02,72.05 58.85,72.05 58.85,70.09 65,70.09 65,69.74 69.36,69.74 69.36,72.42 69.36,73.48 49.21,73.48 49.21,68.74 53.75,68.74 53.75,67.86 54.75,67.86 54.75,67.61 56.02,67.61
  pour Top (no thermals): 56.07,64.68 56.07,62.76 59.28,62.76 59.28,60.79 59.1,60.79 49.1,60.79 49.1,63.15 49.82,63.15 49.82,62.03 51.2,62.03 51.2,62.38 53.56,62.38 53.56,63.29 54.77,63.29 54.77,64.68
  pour Top (no thermals): 28.66,81.26 28.66,83.17 24.98,83.17 24.98,84.9 23.86,84.9 23.86,79.37 25.05,79.37 25.05,81.26
  pour Top (no thermals): 48.12,85.06 48.45,85.06 48.45,87.7 49.99,87.7 49.99,77.19 48.54,77.19 48.54,80.79 48.12,80.79
  pour Top: 2.22,75.27 10.48,75.27 15.35,70.4 14.39,69.44 14.39,69.08 14.39,35.22 16.64,32.97 56.99,32.97 62.06,38.04 62.06,44.45 60.47,46.04 60.47,52.87 60.48,52.88 58.61,54.75 56.69,54.75 55.51,55.93 53.22,55.93 51.64,55.93 49.45,58.12 49.45,60.09 49.45,60.93 49.59,61.07 49.68,61.16 59.09,61.16 59.83,60.42 72.42,60.42 72.68,60.68 72.68,61.09 72.68,70.21 73.33,70.86 76.25,70.86 77.33,69.78 77.33,0.6 71.44,-5.29 1.72,-5.29 -4.49,0.92 -4.49,68.57 1.32,74.38 1.33,74.38
  pour Bottom: 8.22,54.1 9.97,55.85 11.42,55.85 12.61,54.66 12.61,54.42 12.61,36.27 16.78,32.1 26.63,32.1 31.21,36.68 43.05,36.68 47.02,32.71 57.14,32.71 62.53,38.1 62.53,39.46 62.53,44.7 60.92,46.31 60.92,47 60.92,54.29 61.25,54.62 64.53,54.62 65.56,53.59 65.56,0.07 64.4,-1.09 8.59,-1.09 7.47,0.03 7.47,53.35
  pour Top: -1.58,75.06 11.19,75.06 15.46,70.79 15.46,78.64 19.87,83.05 22.6,83.05 24,81.65 24.3,81.65 25.2,82.55 23.6,84.15 23.6,85 23.6,88.43 23.86,88.69 27.64,88.69 27.77,88.82 27.77,90.24 28.27,90.74 29.18,90.74 29.46,90.46 29.91,90.01 29.91,88.58 31.9,88.58 32.21,88.89 35.54,88.89 35.94,88.49 38.57,88.49 39.48,89.4 41.51,89.4 42.05,89.94 42.05,90.75 42.06,90.76 49.97,90.76 50.58,90.15 50.58,73.37 69.37,73.37 69.37,69.74 77.18,69.74 77.23,69.69 77.26,73.91 77.26,94.53 60.52,111.27 14.39,111.27 -2.23,94.65 -2.39,94.49 -2.39,75.19 -2.26,75.06
  pour Top: 22.8,81.5 24.09,81.5 24.65,80.94 24.65,80 23.78,79.13 23.78,76.46 24.08,76.16 30.07,76.16 31.07,77.16 33.39,77.16 34.69,75.86 35.02,75.86 35.41,75.47 35.93,74.95 36.77,74.95 40.34,74.95 40.98,74.31 42.44,74.31 42.91,73.84 49.61,73.84 49.61,69.16 47.74,67.29 47.74,62.46 46.48,61.2 43.33,61.2 42.18,62.35 31.04,62.35 30.66,61.97 28.33,61.97 26.29,64.01 26.29,74.64 25.87,75.06 19.86,75.06 17.15,72.35 17.07,72.35 17.07,77.68 20.76,81.37 22.67,81.37
  pour Bottom: -0.97,54.81 12.44,54.81 12.58,54.67 12.58,67.93 20.18,75.53 25.7,75.53 26.52,74.71 26.52,64.4 28.42,62.5 43.91,62.5 51.65,54.76 51.65,54.65 77.9,54.65 77.9,58.54 75.83,60.61 69.43,60.61 68.72,61.32 68.72,73.49 68.74,73.51 55.82,73.51 55.51,73.82 55.4,73.93 55.4,79.48 54.55,80.33 4.58,80.33 -1.7,74.05 -1.7,55.54
  pour Bottom: -1.2,77.72 26.26,77.72 29.17,80.63 29.17,83.62 29.66,84.11 29.82,84.11 30.71,83.22 31.62,83.22 32.23,82.61 32.45,82.39 33.16,82.39 33.35,82.58 33.35,85.45 33.69,85.79 34.16,85.79 34.42,86.05 34.42,87.17 36.04,87.17 36.5,86.71 36.5,84.85 35.83,84.18 34.78,84.18 34.69,84.27 34.69,82.63 35.01,82.31 41.25,82.31 42.09,83.15 58.87,83.15 59.01,83.01 59.01,76.52 59.4,76.13 71.73,76.13 71.93,75.93 71.93,60.5 72.1,60.33 76.51,60.33 76.72,60.54 76.72,85.26 53.88,108.1 19.54,108.1 -0.4,88.16 -0.4,78.53 -1.2,77.73
  pour Bottom: 20.22,75 14.58,69.36 14.58,51.34 14.58,35.85 17.15,33.28 27.02,33.28 28.54,34.8 28.54,38.2 26.45,40.29 24.5,42.24 24.5,49.95 24.5,53.47 30.62,59.59 26.09,64.12 26.09,68.45 26.09,74.11 26.09,74.45 25.58,74.96 20.26,74.96
  pour Top: 15.83,70.46 14.74,69.37 14.74,67.04 18.66,67.04 18.73,67.11 18.73,67.64 17.5,68.87 17.4,68.97 17.4,71.34 17.42,71.36 16.73,71.36
  pour Bottom: 47.65,33.04 56.59,33.04 62.22,38.67 62.22,44.14 60.61,45.75 60.61,52.38 58.68,54.31 53.42,54.31 51.47,52.36 51.47,42.92 48.96,41 47.65,39.69 49.55,41
I2CADDR
  Top 0.152: PS2.38 34.57,77.27 34.5,77.2 34.5,76.5 34.6,76.39 34.6,76.34 RPMU7.1
I2CALERT  (via drill 0.2)
  Top 0.152: PS2.41 36.12,78.02 v36.12,77.06
  Bottom 0.152: RPMU8.1 36.12,77.77 v36.12,77.06
IO0  (via drill 0.35)
  Top 0.152: R37.2 23.89,5.31 23.89,6.51 23.87,6.54 v23.87,7.61 | R22.1 27.94,17.95 U1.25 29.13,18 v29.38,17.75 | v31.46,17.2 31.46,14.4 v31.55,14.31
  Bottom 0.152: v29.38,17.75 29.93,17.2 v31.46,17.2 | v23.87,7.61 25.04,7.61 25.56,7.09 25.56,3.5 25.82,3.24 28,3.24 32.17,7.41 32.17,13.92 31.78,14.31 v31.55,14.31
IO2
  Top 0.152: R23.2 31.05,19.71 U1.24
L_EMITTER  (via drill 0.35)
  Top 0.152: T4.G 12.84,84.96 R8.2 12.98,84.02 13.15,84.02 13.21,83.96 v13.59,83.96 | v26.19,4.08 26.24,4.03 U1.36
  Bottom 0.152: v26.19,4.08 26.19,9.26 20.98,14.47 16.06,14.47 12.73,17.8 12.73,19.38 12.73,80.93 13.59,81.79 v13.59,83.96
L_ENC_A  (via drill 0.35)
  Top 0.152: J6.1 29.47,33.92 34.57,33.92 37,31.49 v37,26.11 | v39.34,17.5 41.9,14.94 41.9,7.32 42.65,6.57 45.91,6.57 45.95,6.53 U1.5
  Bottom 0.152: v37,26.11 39.34,23.77 v39.34,17.5
L_ENC_B  (via drill 0.35)
  Top 0.152: J6.2 27.24,33.61 34.44,33.61 36.26,31.79 36.26,26.33 v35.98,26.05 | v37.87,17.48 41.32,14.03 | 41.32,14.03 | 41.32,14.03 41.32,6.74 42.76,5.3 U1.4
  Bottom 0.152: v35.98,26.05 37.87,24.16 v37.87,17.48
L_RECEIVER1
  Top 0.152: Q2.2 16.86,95.05 R15.2 19.21,92.45 21.53,90.13 21.53,87.01 11.48,76.96 11.48,20.5 12.62,19.36 23.86,19.36 24.97,20.47 33.09,20.47 33.22,20.33 33.22,20.08 U1.22
L_RECEIVER2
  Top 0.152: Q3.2 27,98.58 R16.2 28.44,98.25 29.17,97.52 29.17,93.72 24.63,89.18 24.13,89.18 11.81,76.86 11.81,20.71 12.73,19.79 23.86,19.79 24.84,20.77 34.05,20.77 34.49,20.33 34.49,20.08 U1.21
LF_EMITTER/TCK  (via drill 0.35)
  Top 0.152: T5.G 26.06,94.69 R11.2 26.05,94.39 26.22,94.39 26.47,94.14 v27.06,94.14 | v43.99,16.89 43.99,10.99 v44.46,10.52 | U1.16 41.47,19.46 41.47,18.41 41.66,18.22 v42.05,18.22 | v40.56,13.89 37.45,13.89 37.45,13.81 37.56,13.7 37.56,13.2 36.78,12.42 33.9,12.42 33.76,12.29 33.76,10.2 v30.05,6.49
  Bottom 0.152: v27.06,94.14 27.84,93.36 27.84,89.96 27.83,89.97 27.83,85.36 13.55,71.08 13.34,71.08 13.04,70.77 13.04,25.64 13.04,17.93 16.19,14.78 21.11,14.78 26.49,9.39 26.49,5.55 29.11,5.55 v30.05,6.49 | v43.99,16.89 42.74,18.14 42.13,18.14 v42.05,18.22 | JTAG.2 62.54,8.83 62.54,9.43 62.37,9.6 61.95,9.6 60.08,9.6 59.26,8.78 49.55,8.78 47.81,10.52 v44.46,10.52 41.09,13.89 v40.56,13.89
LF_RECEIVER
  Top 0.152: Q4.2 11.65,88.91 R17.2 16.64,87.38 16.64,82.55 11.16,77.07 11.16,20.27 12.43,19 29.31,19 30.18,18.13 30.18,17.33 29.67,16.82 28.08,16.82 28.07,16.81 | U1.26 28.07,16.81 | 28.07,16.81 28.27,17.01
LPWMA  (via drill 0.35)
  Top 0.152: IC8.2 R52.1 12.86,47.71 12.86,22.39 14,21.25 14.5,21.25 14.54,21.21 v14.77,21.21 | v20.73,17.47 21.44,17.47 21.83,17.08 21.83,15.87 23.4,14.3 23.4,14.03 27.05,10.38 U1.31
  Bottom 0.152: v14.77,21.21 18.02,17.96 20.24,17.96 v20.73,17.47
LPWMB  (via drill 0.35)
  Top 0.152: IC8.4 R53.1 16.22,48.56 16.05,48.56 13.34,45.85 13.34,23.15 14.3,22.19 14.77,22.19 v14.8,22.22 | U1.30 26.44,11.65 23.71,14.39 23.71,14.43 22.22,15.91 22.22,17.53 21.36,18.39 v20.97,18.39
  Bottom 0.152: v14.8,22.22 18.63,18.39 v20.97,18.39
M_EMITTER/TDO  (via drill 0.35)
  Top 0.152: v35.19,95.7 34.46,96.42 R13.2 T6.G | U1.23 32.55,15.6 v32.67,15.47
  Bottom 0.152: JTAG.1 45.1,8.34 37.97,15.47 v32.67,15.47 32.12,14.92 31.3,14.92 30.94,14.56 30.94,14.06 31.1,13.9 31.1,7.51 30.74,7.15 27.24,7.15 26.8,7.59 26.8,9.51 21.16,15.15 16.26,15.15 13.34,18.07 13.34,70.28 35.19,92.13 v35.19,95.7
N1D
  Top 1.016: Q10.2 60.74,41.31 59.99,41.31 59.6,40.92 59.6,40.1 59.28,39.78 59.28,39.58 57.87,38.17 56.28,38.17 55.99,37.88 55.99,36.77 54.39,35.17 J5.5
N1D_2
  Top 1.016: Q11.2 23.36,41.55 22.61,41.55 20.86,39.8 J6.5
N1G  (via drill 0.35)
  Top 0.152: v57.07,40.49 56.91,40.33 Q10.8 | v60.7,39.23 60.7,40 Q10.1 | 57.09,49.88 v57.06,49.9 IC6.7
  Bottom 0.152: v60.7,39.23 58.33,39.23 v57.07,40.49 57.07,46.83 57.06,46.84 v57.06,49.9
N1G_2  (via drill 0.35)
  Top 0.152: Q11.1 v25.1,40.56 | v24.38,51.93 23.7,51.25 IC8.7 | Q11.8 18.22,40.22 v17.51,39.51
  Bottom 0.152: v24.38,51.93 24.38,50.95 24.01,50.57 24.01,44.39 24.01,41.65 v25.1,40.56 24.05,39.51 v17.51,39.51
N2D
  Top 1.016: Q10.6 55.7,42.76 57.18,42.76 58.2,41.74 58.11,41.65 58.11,40.06 57.39,39.34 55.39,39.34 J5.6
N2D_2
  Top 1.016: J6.6 18.22,37.55 18.22,38.54 19.64,39.97 19.64,42.43 19.05,43.03 18.3,43.03 Q11.6
N2G
  Top 0.152: IC6.5 58.65,46.5 58.67,46.49 59.18,46.49 59.31,46.35 59.31,45.85 Q10.4 60.43,43.55 56.19,43.55 Q10.5
N2G_2
  Top 0.152: Q11.5 Q11.4 23.09,44.92 IC8.5
N$1
  Top 0.152: IC1.18 53.98,64.9 R21.2 53.33,62.03 53.12,61.82 C5.1
N$2
  Top 0.305: C1.1 58.07,67.74 58.07,67.7 57.79,67.43 IC1.8
N$3
  pour Top (no thermals): 57.08,65.33 57.78,65.33 57.78,65.69 59.91,65.69 59.91,60.85 63.78,60.85 63.78,67.06 57.04,67.06 57.04,65.33
N$4
  pour Top (no thermals): 56.64,64.08 56.64,64.31 56.39,64.31 56.39,63.56 56.39,63.17 58.66,63.17 58.66,63.92 56.64,63.92
N$6
  Top 0.152: C47.1 57.76,70.96 57.61,70.81 | IC1.10
  Top 0.305: 57.61,70.81 56.46,69.66 IC1.10
N$12
  Top 0.152: R46.2 13.88,7.53 T2.1
N$13
  Top 0.305: LED5.1 39.77,103.89 39.36,103.89 35.29,103.87 LED7.2
N$14
  Top 0.152: IC1.19 53.99,64.41 R26.2
N$15
  Top 0.152: C2.1 52.26,64.33 52.37,64.43 52.57,64.43 52.7,64.56 52.7,64.76 R21.1
N$16
  Top 0.152: LED1.1 68.11,86.25 68.11,87.14 67.68,87.57 65.94,87.57 R4.2
N$17
  Top 0.152: R4.1 63.19,86.62 T8.D
N$20
  Top 0.305: LED7.1 30.55,100.74 31.91,99.38 R12.2
N$21
  Top 0.152: LED2.1 9.89,85.06 R5.2
N$22
  Top 0.152: R5.1 11.53,86.78 T4.D
N$23
  Top 0.305: R12.1 34.65,99.03 T6.D
N$24
  Top 0.152: C43.2 24.67,4.39 R37.1 24.64,4.25 PB1.2
N$26
  Top 0.152: LED3.1 53.66,97.7 R7.2
N$27
  Top 0.152: R7.1 50.66,94.84 50.66,94.9 50.68,94.91 50.68,96.1 50.66,96.12 50.66,97.09 50.44,97.31 T7.D
N$28
  Top 0.305: T1.4 22.32,58.49 21.92,58.49 21.39,59.02 21.39,60.39 21.21,60.56 20.96,60.56 IC9.6
N$29
  Top 0.152: IC1.17 52.09,65.43 R24.2 50.87,64.75 R25.1
N$30
  Top 1.016: J7.P$2 25.27,66.63 D6.2 25.27,60.16 T1.MB
N$31
  Top 0.152: LED4.1 23.89,98.65 R10.2
N$32
  Top 0.152: R10.1 25.1,95.81 T5.D
N$34
  Top 0.406: IC1.3 57.41,64.95 58.12,64.95 58.12,65.03 R27.1
N$37
  Bottom 0.152: PB2.2 11.75,4.17 R38.1 13.26,5.8 C44.2
N$45
  Top 0.152: PLZ6V2B-G3/H.A 13.45,8.96 R46.1 12.43,8.89 R45.2
N$46
  Top 0.152: R48.1 16.41,11.09 | 16.41,11.09 16.41,10.09 T2.3 | R47.1 18.05,11.09 16.41,11.09
N$47
  Top 0.152: R47.2 18.17,8.07 T3.1
N$48
  Top 0.152: R48.2 16.41,12.22 16.09,11.9 15.77,11.9 15.63,11.76 15.63,11.44 D3.C
N$49  (via drill 0.35)
  Top 0.152: U$8.2 27.76,68.17 v27.84,68.25
  Bottom 0.152: v27.84,68.25 27.98,68.39 C42.1
N$50
  Top 0.152: D5.C 19.82,11.94 R49.2
N$51
  Top 0.152: R49.1 20.03,10.24 T3.3
N$56  (via drill 0.35)
  Top 0.152: v28.75,68.24 28.46,67.95 U$8.3
  Bottom 0.152: C42.2 28.75,68.74 v28.75,68.24
N$57  (via drill 0.35)
  Top 0.152: U$8.4 29.16,62.45 v29.06,62.35
  Bottom 0.152: v29.06,62.35 28.98,62.43 C41.1
N$58  (via drill 0.35)
  Top 0.152: U$8.5 29.86,62.49 v29.98,62.37
  Bottom 0.152: v29.98,62.37 29.98,63.56 C41.2
N$59  (via drill 0.35)
  Top 0.152: U$8.27 45.26,62.39 v45.29,62.36
  Bottom 0.152: v45.29,62.36 45.29,62.64 45.45,62.8 45.45,66.37 C40.1
N$60  (via drill 0.35)
  Top 0.152: U$8.28 45.96,62.91 v46.38,62.49
  Bottom 0.152: v46.38,62.49 46.38,63.85 C7.1
N$61  (via drill 0.35)
  Top 0.152: U$8.14 36.16,63.03 36.16,62.62 v36.17,62.61
  Bottom 0.152: v36.17,62.61 36.12,62.66 36.13,62.67 | 36.13,62.67 35.37,63.42 D4.2 | R35.1 37.4,63.94 36.13,62.67
N$63  (via drill 0.35)
  Top 0.152: U$8.26 44.29,64.87 44.29,63.05 44.16,62.91 44.13,62.91 v43.83,62.61
  Bottom 0.152: v43.83,62.61 43.83,66.46 R1.2
N$68
  Top 0.152: CCOMP6.1 31.86,90.22 31.86,87.42 32.01,87.28 RCOMP7.1
N$74
  Top 0.152: RCOMP6.1 39.49,89.95 CCOMP8.2
N$80
  Top 0.152: RCOMP8.2 32.48,76.03 32.48,75.5 31.87,74.9 CCOMP9.2
N$85
  Top 0.152: RCOMP5.2 38.55,74.96 CCOMP11.2
OUT1
  Top 0.152: CBST1.2 42.32,78.84 41.91,79.25 41.83,79.25
  Top 0.305: PS2.2 41.76,79.32 41.83,79.25 | PS2.3 41.34,79.82 41.6,79.56 | 41.6,79.56 41.91,79.25 | PS2.4 40.84,80.32 41.6,79.56
  pour Top (no thermals): 40.9,80.42 48.07,80.42 48.07,77.7 40.9,77.7 40.9,79.18
OUT2
  Top 0.152: CBST2.2 42.23,85.96 41.88,85.61 41.88,83.9 41.66,83.68 41.6,83.62
  Top 0.305: PS2.11 41.52,83.82 41.66,83.68 | PS2.10 41.3,83.32 41.6,83.62 40.8,82.82 PS2.9
  pour Top (no thermals): 40.92,83.31 42.23,83.31 42.23,85.41 48.13,85.41 48.13,87.44 41.61,87.44 41.61,83.94 40.92,83.94
OUT3
  Top 0.152: CBST3.1 30.79,83.67 30.79,83.28 32.12,83.28 32.15,83.25 32.15,82.41 32.24,82.32 PS2.29
  pour Top (no thermals): 33.7,82.46 32.34,82.46 32.34,83.44 31.09,83.44 31.09,84.73 25.39,84.73 25.39,83.61 30.41,83.61 30.41,82.93 31.93,82.93 31.93,82.23 33.7,82.23
OUT4
  Top 0.152: CBST4.1 30.49,80.65 30.66,80.82 PS2.32
  pour Top (no thermals): 33.7,80.93 25.47,80.93 25.47,79.38 31.03,79.38 31.03,80.63 33.7,80.63
PGOOD  (via drill 0.2)
  Top 0.152: PS2.17 v37.57,85.99
  Bottom 0.152: v37.57,85.99 36.99,85.99 RPMU12.1
R_EMITTER  (via drill 0.35)
  Top 0.152: T7.G R9.2 48.71,94.52 48.54,94.52 48.31,94.29 v47.7,94.29 | v29.38,7.96 29.26,7.84 U1.33
  Bottom 0.152: v47.7,94.29 45.36,91.95 44.05,91.95 42.73,93.27 36.97,93.27 13.64,69.94 13.64,18.2 16.35,15.49 21.25,15.49 27.1,9.64 27.1,8.52 27.66,7.96 v29.38,7.96
R_ENC_A  (via drill 0.35)
  Top 0.152: J5.1 50.72,33.61 58.46,33.61 59.1,32.97 59.1,24.54 v59.4,24.24 | v59.34,19.09 59.14,18.89 59.14,14.08 58.61,13.55 58.61,11.2 57.47,10.06 52.82,10.06 51.83,9.07 46.04,9.07 U1.7
  Bottom 0.152: v59.4,24.24 59.4,19.09 v59.34,19.09
R_ENC_B  (via drill 0.35)
  Top 0.152: J5.2 45.42,33.67 39.79,33.67 | v40.83,17.53 41.54,16.82 41.54,16.79 41.9,16.43 41.93,16.43 42.68,15.68 42.68,8.38 43.24,7.82 45.97,7.82 U1.6 | 39.79,33.67 39.66,33.55 39.66,24.63 v39.62,24.59 | 39.79,33.67
  Bottom 0.152: v39.62,24.59 39.92,24.29 39.92,22.07 40.83,21.15 v40.83,17.53
R_RECEIVER1
  Top 0.152: Q5.2 59.53,92.58 R18.2 57.67,91.87 57.67,91.54 57.65,91.52 57.65,87.78 57.95,87.49 57.95,83.88 58.15,83.67 60.95,83.67 61.54,83.08 61.54,77.27 62.04,76.77 71.24,76.77 72.41,75.6 72.41,70.79 73.32,69.88 73.32,60.27 72.47,59.41 62.49,59.41 61.6,58.52 61.6,46.59 63.14,45.04 63.14,25.24 58.68,20.79 39.07,20.79 38.88,20.6 38.88,19.5 U1.18
R_RECEIVER2
  Top 0.152: Q6.2 49.32,99.83 R19.2 47.78,97.96 47.05,97.23 47.05,95.79 46.19,94.93 46.19,91.57 46.62,91.14 49.83,91.14 53.11,87.86 57.14,87.86 57.64,87.36 57.64,83.75 58.02,83.36 60.83,83.36 61.24,82.96 61.24,77.13 61.9,76.46 71.12,76.46 72.1,75.48 72.1,70.67 73.02,69.76 73.02,68.69 73.02,68.68 73.02,60.4 72.36,59.73 70.77,59.73 70.75,59.72 62.22,59.72 61.29,58.79 61.29,46.46 62.84,44.92 62.84,25.37 58.59,21.12 58.01,21.12 57.98,21.09 37.84,21.09 37.63,20.87 U1.19
RCLOCK
  Top 0.152: PS2.40 35.57,74.46 ROSC1.2
REGOUT
  Top 0.152: IC3.10 52.44,11.48 C31.1
RF_EMITTER  (via drill 0.35)
  Top 0.152: T8.G 60.73,84.96 R6.2 60,85.11 v60,86 | v26.41,14.23 26.45,14.19 U1.28
  Bottom 0.152: v60,86 56.78,89.22 53.09,89.22 49.5,92.81 48.21,92.81 47.05,91.65 43.92,91.65 43.59,91.98 43.25,91.98 42.33,92.9 37.03,92.9 13.95,69.82 13.95,18.32 16.48,15.79 21.38,15.79 22.92,14.25 26.39,14.25 v26.41,14.23
RF_RECEIVER
  Top 0.152: Q7.2 64.62,91.49 64.62,92.29 63.83,93.08 62.01,93.08 R20.2 59.03,90.1 59.03,87.96 | 59.03,87.96 | 59.03,87.96 | 59.03,87.96 59.03,84.19 59.25,83.97 61.08,83.97 61.84,83.21 61.84,77.4 62.17,77.07 71.37,77.07 72.71,75.73 72.71,74.45 72.72,74.44 72.72,70.95 73.63,70.04 73.63,60.15 72.59,59.11 62.63,59.11 61.9,58.38 61.9,46.71 63.44,45.17 63.44,25.12 58.81,20.48 40.9,20.48 40.76,20.33 40.76,20.08 U1.17
RPWMA  (via drill 0.35)
  Top 0.152: IC6.2 53.18,49.83 52.15,49.83 | 52.15,49.83 R29.1 | 50.7,44.29 50.7,41.73 43.37,34.4 40.16,34.4 39.54,34.29 | U1.27 28.13,15.32 28.9,15.32 29.34,15.32 29.71,14.94 31.01,13.65 33,13.65 34.15,14.8 v34.15,17.37 | 39.54,34.29 | 39.54,34.29 39.39,34.14 37.97,34.14 37.74,33.91 37.74,24.26 v35.48,22.01 | 50.7,44.29 | 50.7,44.29 50.7,44.67 51.01,46.46 51.01,46.58 51.74,47.3 51.79,47.3 52.1,47.61 52.1,49.77 52.15,49.83
  Bottom 0.152: v35.48,22.01 35.48,18.7 v34.15,17.37
RPWMB  (via drill 0.35)
  Top 0.152: IC6.4 53.09,47.2 IC6.4 | R30.1 52.83,46.94 | U1.29 34.89,12.92 34.89,15.83 35.9,16.83 v35.31,17.42 | v36.53,22.03 36.53,22.06 37.19,22.72 38.04,23.57 38.04,33.78 38.09,33.83 39.52,33.83 39.68,34 39.79,34.02 43.46,34.02 51,41.56 51,44.16 51.13,44.3 52.41,44.3 52.96,44.85 52.96,47.07 52.83,46.94 | 52.83,46.94 | IC6.4 52.83,46.94
  Bottom 0.152: v35.31,17.42 35.46,17.42 36.03,17.99 36.03,21.53 v36.53,22.03
RST_N  (via drill 0.2)
  Top 0.152: PS2.39 35.07,77.02 v35.03,76.98
  Bottom 0.152: v35.03,76.98 35.03,77.8 RPMU9.1
RXD  (via drill 0.35)
  Top 0.152: U1.34 28.58,5.98 28.84,5.98 29.47,5.35 29.74,5.35 31.24,3.84 36.57,3.84 38.63,1.78 42,1.78 42.66,2.44 v44.42,2.44
  Bottom 0.152: UART.3 58.73,1.4 45.53,1.4 44.49,2.44 v44.42,2.44
SCL  (via drill 0.35)
  Top 0.152: U1.12 47.67,15.46 v47.82,15.31 | v61.2,17.35 61.2,20.06 v62.24,21.1 | U$8.18 39.23,64.87 39.23,63.37 | 39.23,63.37 39.23,63.05 39.97,62.31 42.22,62.31 42.95,61.58 v46.06,61.58 | v50.06,58.18 53.2,58.18 v53.29,58.09 | v38.68,62.61 39.23,63.16 39.23,63.37
  Bottom 0.152: v47.82,15.31 48.61,15.31 49.15,15.85 51.5,15.85 53.5,17.85 59.97,17.85 60.5,17.32 61.17,17.32 v61.2,17.35 | v62.24,21.1 62.04,21.3 62.04,44.5 60.49,46.05 60.49,52.89 55.29,58.09 v53.29,58.09 | v46.06,61.58 49.46,58.18 v50.06,58.18 | R2.1 38.68,62.95 v38.68,62.61
SCLK
  Top 0.152: IC3.23 51.57,15.38 51.57,15.71 51.43,15.84 51.05,15.84 50.55,15.34 50.12,15.34 47.7,12.92 U1.10
SCLPMU  (via drill 0.2)
  Top 0.152: PS2.43 37.07,76.48 v36.13,75.54
  Bottom 0.152: v36.13,75.54 36.98,76.39 37.6,76.39 38.19,76.98 RPMU11.1
SDA  (via drill 0.35)
  Top 0.152: U$8.20 U$8.19 39.63,65.12 v39.63,67.79 | v19.82,17.28 23.1,14.01 23.1,13.9 25.58,11.42 25.58,3.83 26.06,3.35 27.4,3.35 U1.37
  Bottom 0.152: v19.82,17.28 20.06,17.28 20.48,16.86 20.98,16.86 21.73,17.61 21.73,21.13 21.43,21.43 16.54,21.43 14.25,23.71 14.25,69.53 20.12,75.4 25.7,75.4 26.84,74.26 26.84,68.07 27.28,67.63 39.47,67.63 v39.63,67.79 40.47,67.79 R3.1
SDAPMU  (via drill 0.2)
  Top 0.152: PS2.42 36.57,77.36 36.65,77.28 36.65,76.83 v36.12,76.3
  Bottom 0.152: v36.12,76.3 36.39,76.3 RPMU10.1
SDI
  Top 0.152: IC3.24 50.97,15.04 50.24,15.04 46.86,11.65 U1.9
SDO
  Top 0.152: IC3.9 52.04,9.71 51.7,9.37 48.95,9.37 47.94,10.38 U1.8
SS1
  Top 0.152: PS2.45 38.07,77.44 37.87,77.24 37.87,76.53 36.4,75.06 CSS8.2
SS2
  Top 0.152: PS2.16 38.07,85.74 38.1,85.77 38.1,86.21 37.33,86.98 37.16,86.98 37.02,87.11 37.02,87.14 CSS5.1
SS3
  Top 0.152: PS2.24 34.07,86.44 CSS6.1
SS4
  Top 0.152: CSS7.1 34.3,73.26 34.3,76.27 34.07,76.49 PS2.37
TDI  (via drill 0.35)
  Top 0.152: U1.14 44.86,18 v44.68,17.82 44.68,11.84 v44.65,11.81
  Bottom 0.152: v44.65,11.81 45.22,11.24 58.78,11.24 59.95,10.07 61.09,10.07 62.28,11.26 J3.2
TXD  (via drill 0.35)
  Top 0.152: U1.35 28.25,5.04 29.61,5.04 31.19,3.46 36.36,3.46 38.43,1.39 v44.37,1.39
  Bottom 0.152: v44.37,1.39 44.67,1.09 47.08,1.09 47.18,1.09 | 47.18,1.09 | 47.18,1.09 62.66,1.09 63.04,1.47 UART.4
VBATT  (via drill 0.2, 0.35)
  Top 0.152: PS2.22 35.07,86.25 v34.97,86.25 | v18.43,16.83 v18.44,16.82 18.44,13.33 | 18.44,13.33 19.35,13.33 D5.A | 18.44,13.33 17.94,13.83 15.33,13.83 14.85,13.35 D3.A 13.58,12.42 PLZ6V2B-G3/H.K | J2.P$1 57.75,81.98 C8.2
  Top 0.305: PS2.6 41.83,81.32 v42.12,81.03 41.91,80.82 PS2.5
  Bottom 0.203: v71.82,62.06 72.23,61.65 72.23,57.53 71.32,56.62 71.29,56.62 65.01,56.62 64.55,56.62 63.89,55.96 63.89,55.47 63.88,55.46 63.88,20.25 61.89,18.26 53.44,18.26 51.36,16.18 20.03,16.18 19.37,16.84 v18.43,16.84 v18.43,16.83
  other vias: 35.73,86.27 42.83,81.41 42.15,81.8 32.17,81.55 31.21,81.55 31.21,82.31 70.37,66.36 71.82,66.32 71.08,65.1 70.31,64.1 71.07,63 71.77,64.11 70.3,62.07
  pour Top (no thermals): 40.94,81.41 41.87,81.41 41.87,82.12 43.49,82.12 43.49,82.78 45.07,82.78 45.07,80.74 40.94,80.74 40.94,81.4
  pour Top (no thermals): 33.66,81.91 31.62,81.91 31.62,82.61 30.07,82.61 30.07,83.29 29.59,83.29 29.59,81.24 33.66,81.24 33.66,81.9
  pour Top (no thermals): 35.25,84.68 34.89,84.68 34.89,85.86 34.65,85.86 34.65,86.84 36.05,86.84 36.05,85.76 35.25,85.76
  pour Top (no thermals): 57.74,67.81 57.08,67.81 57.08,69.75 64.53,69.75 64.53,69.4 72.32,69.4 72.32,60.83 64.86,60.83 64.86,68.68 63.83,68.68 63.83,69 57.74,69
  pour Bottom (no thermals): 45.09,80.69 45.09,82.78 43.49,82.78 43.48,82.78 43.48,82.23 41.82,82.23 41.82,81.97 34.38,81.97 34.38,84.49 34.38,84.66 35.19,84.66 35.15,85.77 34.52,85.24 33.73,85.28 33.73,81.93 31.74,81.93 31.65,81.93 31.65,82.65 30.1,82.65 30.1,83.31 29.53,83.31 29.53,81.24 29.53,81.17 33.63,81.17 33.83,81.17 33.83,80.69 35.46,80.69
  pour Bottom (no thermals): 43.47,82.81 58.64,82.81 58.64,75.74 64.37,75.74 64.37,74.01 56.21,74.01 56.21,80.69 43.47,80.69
  pour Bottom (no thermals): 63.57,75.78 71.53,75.78 71.53,61.02 69.63,61.02 69.63,74.01 63.57,74.01
  pour Bottom: 34.74,86.57 36.06,86.57 36.06,84.94 35.77,84.65 34.93,84.65 34.74,84.84
VBOOST
  Top 0.152: 51.59,67.42 C46.1 | R25.2 49.87,63.74 48.89,64.72 48.89,66.38 48.61,66.66 48.61,66.72 | C36.1 21.24,46.77
  Top 1.016: 56.25,48.84 56.41,48.68 58.58,48.68 IC6.6 | 21.43,55.9 25.75,55.9 28.12,58.27 30.43,60.58 31.42,61.57 41.91,61.57 43.03,60.46 46.87,60.46 48.61,62.2 | 21.43,55.9 21.09,55.9 20.02,56.97 20.02,57.98 | 20.02,57.98 20.02,59.63 IC9.5 20.04,60.22 19.29,60.22 16.89,62.62 C38.1 | 20.02,57.98 18.56,57.98 C37.1 | 21.43,55.9 21.2,55.67 C35.1 21.2,51.13 22.06,50.27 22.81,50.27 IC8.6 22.81,49.7 22.06,49.7 21.35,48.99 C36.1 | Q10.7 54.54,41.59 54.2,41.93 53.92,41.93 C50.1 55.07,45.76 C33.1 55.96,46.63 55.96,49.13 56.25,48.84 | 21.24,46.77 20.47,46 17.82,46 16.8,44.97 16.8,43.94 C49.1 16.32,41.83 Q11.7 | 48.61,62.2 48.61,57.7 51.26,55.05 54.03,55.05 54.86,55.05 56.32,53.59 56.32,53.31 C34.1 56.81,52.38 55.44,51.01 55.44,49.65 56.25,48.84 | 49.31,67.42 48.61,66.72 48.61,62.2
  pour Top (no thermals): 54.34,65.98 52.87,65.98 52.87,66.79 49.18,66.79 49.18,68.24 53.42,68.24 53.42,67.1 54.34,67.1
VDDA
  Top 0.152: CVDDA1.2 32.62,88.07 33.41,87.27 35.33,87.27 35.53,87.08 36.2,87.08 36.57,86.7 PS2.19
VDDD  (via drill 0.2)
  Top 0.152: PS2.48 39.45,78.19 39.45,78.56 39.32,78.7 39.23,78.7 39.07,78.7 38.52,79.25 34.63,79.25 34.5,79.38 | PS2.34 33.44,79.94 33.82,79.94 33.95,80.08 33.95,80.16 | 33.95,80.16 33.95,83.06 33.82,83.2 33.44,83.2 33.39,83.25 | 33.39,83.25 PS2.27 | 33.39,83.25 33.89,83.25 34.78,84.14 v34.9,84.14 | PS2.20 36.07,84.4 v36.29,84.18 39.05,84.18 39.32,84.44 39.45,84.58 39.45,84.95 PS2.13 39.84,85.07 v40.22,85.45 | 34.5,79.38 34.5,79.61 33.95,80.16 | 34.5,79.38 34.5,79.24 v34.19,78.93
  Bottom 0.152: v34.9,84.14 34.94,84.18 v36.29,84.18 36.29,85.86 RPMU12.2 | RPMU9.2 34.48,78.93 v34.19,78.93 35.46,78.93 | RPMU8.2 35.46,78.93 | RPMU10.2 36.4,78.93 | 36.4,78.93 35.46,78.93 | RPMU11.2 37.57,78.93 36.4,78.93 | v40.22,85.45 40.53,85.45 CVDD1.1
VDDG
  Top 0.152: CVDDG1.1 35.34,87.84 35.52,87.66 35.52,87.52 35.66,87.38 36.32,87.38 37.04,86.67 37.04,85.77 37.07,85.74 PS2.18
VFB1
  Top 0.152: PS2.47 39.19,77.95 39.19,77.58 39.32,77.44 39.7,77.44 39.91,77.23 39.91,75.8 40.53,75.18 RFBB8.2 42.36,74.65 RFBT6.1
VFB2
  Top 0.152: PS2.14 39.19,85.19 39.19,85.83 40.49,87.12 41.12,87.12 41.2,87.2 RFBB5.2 41.99,87.88 RFTB5.1
VFB3
  Top 0.152: PS2.26 33.2,83.94 32.82,83.94 32.69,84.08 32.69,84.45 32.61,84.53 32.33,84.53 31.76,85.1 31.57,85.1 30.87,85.8 30.87,86.02 29.99,86.89 29.88,86.89 29.68,87.1 29.68,88.62 | 29.68,88.62 29.41,88.89 RFBT8.1 | 29.68,88.62 29.68,89.17 RFBB6.2
VFB4
  Top 0.152: PS2.35 33.2,79.2 32.82,79.2 32.69,79.06 32.69,78.69 32.15,78.15 RFBB7.1 31.32,78.33 RFBT5.2

## Text on the board
tPlace: The Jerrys | v2.0 | Jaap de Dood / Roswell Tiongco / Ricardo Alcaraz | M2 | TMS | TDI | TDO | TCK | TXD | 3V3 | GND | RXD